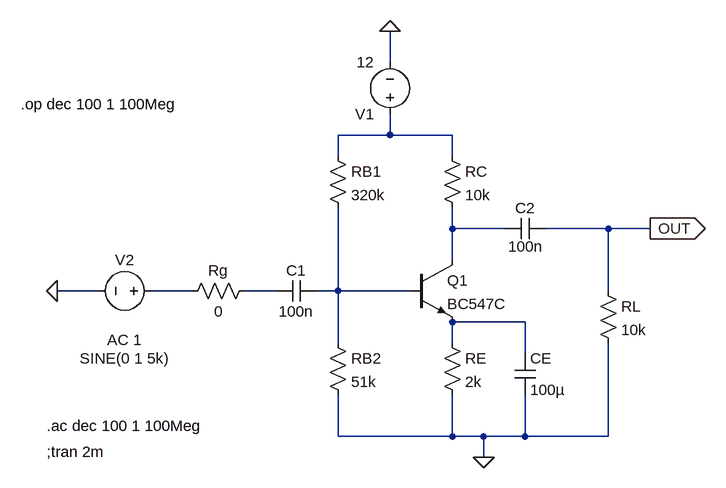
[diagram p0: schematic wzmacniacz.asc]
wzmacniacz.asc, the LTspice schematic file:
Version 4
SHEET 1 1300 680
WIRE 624 48 624 0
WIRE 624 160 624 128
WIRE 624 160 544 160
WIRE 720 160 624 160
WIRE 544 192 544 160
WIRE 720 192 720 160
WIRE 720 304 720 272
WIRE 800 304 720 304
WIRE 960 304 864 304
WIRE 1024 304 960 304
WIRE 720 352 720 304
WIRE 176 400 112 400
WIRE 320 400 256 400
WIRE 448 400 400 400
WIRE 544 400 544 272
WIRE 544 400 512 400
WIRE 656 400 544 400
WIRE 960 400 960 304
WIRE 832 448 720 448
WIRE 544 480 544 400
WIRE 720 480 720 448
WIRE 832 496 832 448
WIRE 544 624 544 560
WIRE 720 624 720 560
WIRE 720 624 544 624
WIRE 768 624 720 624
WIRE 832 624 832 560
WIRE 832 624 768 624
WIRE 960 624 960 480
WIRE 960 624 832 624
WIRE 768 656 768 624
FLAG 112 400 0
FLAG 1024 304 OUT
IOPIN 1024 304 Out
FLAG 768 656 0
FLAG 624 0 0
SYMBOL voltage 624 144 R180
WINDOW 123 0 0 Left 0
WINDOW 39 0 0 Left 0
SYMATTR InstName V1
SYMATTR Value 12
SYMBOL voltage 272 400 R90
WINDOW 0 -32 56 VBottom 2
WINDOW 3 88 56 VTop 2
WINDOW 123 60 56 VTop 2
WINDOW 39 0 0 Left 0
SYMATTR InstName V2
SYMATTR Value SINE(0 1 5k)
SYMATTR Value2 AC 1
SYMBOL res 416 384 R90
WINDOW 0 0 56 VBottom 2
WINDOW 3 32 56 VTop 2
SYMATTR InstName Rg
SYMATTR Value 0
SYMBOL cap 512 384 R90
WINDOW 0 0 32 VBottom 2
WINDOW 3 32 32 VTop 2
SYMATTR InstName C1
SYMATTR Value 100n
SYMBOL res 528 464 R0
SYMATTR InstName RB2
SYMATTR Value 51k
SYMBOL res 528 176 R0
SYMATTR InstName RB1
SYMATTR Value 320k
SYMBOL res 704 176 R0
SYMATTR InstName RC
SYMATTR Value 10k
SYMBOL res 704 464 R0
SYMATTR InstName RE
SYMATTR Value 2k
SYMBOL res 944 384 R0
SYMATTR InstName RL
SYMATTR Value 10k
SYMBOL npn 656 352 R0
SYMATTR InstName Q1
SYMATTR Value BC547C
SYMBOL cap 800 320 R270
WINDOW 0 32 32 VTop 2
WINDOW 3 -27 33 VTop 2
SYMATTR InstName C2
SYMATTR Value 100n
SYMBOL cap 816 496 R0
SYMATTR Value 100µ
SYMATTR InstName CE
TEXT 96 608 Left 2 !.ac dec 100 1 100Meg
TEXT 96 648 Left 2 !;tran 2m
TEXT 56 112 Left 2 !.op dec 100 1 100Meg

The netlist it stands for:
* wzmacniacz.asc
V1 N001 0 12
V2 N003 0 SINE(0 1 5k) AC 1
Rg N004 N003 0
C1 N005 N004 100n
RB2 N005 0 51k
RB1 N001 N005 320k
RC N001 N002 10k
RE N006 0 2k
RL OUT 0 10k
Q1 N002 N005 N006 0 BC547C
C2 N002 OUT 100n
CE N006 0 100µ
.model NPN NPN
.model PNP PNP
.lib standard.bjt
.ac dec 100 1 100Meg
;tran 2m
.op dec 100 1 100Meg
.backanno
.end